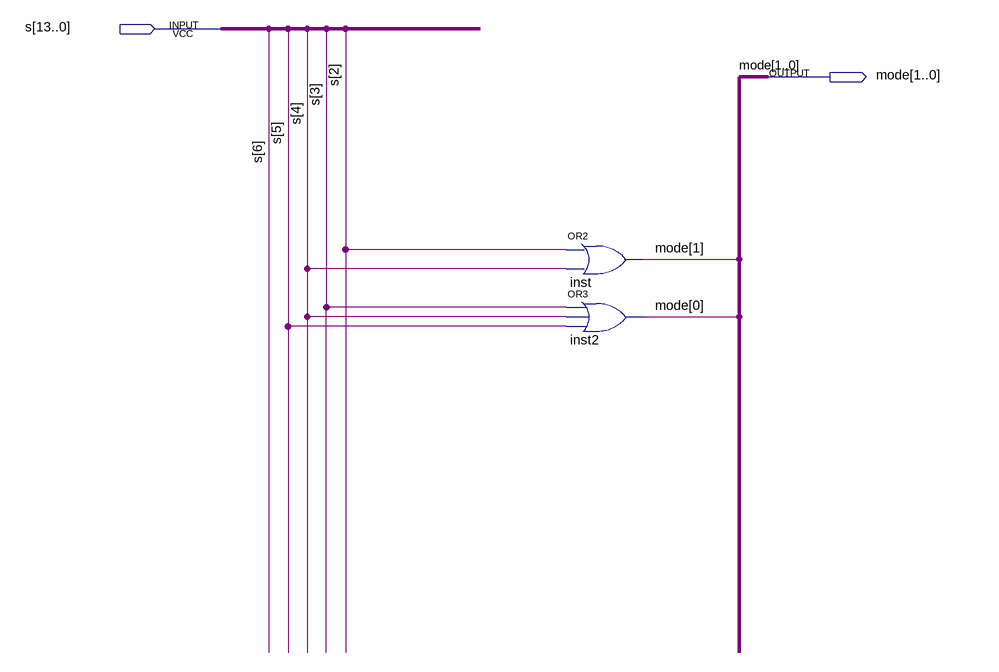
[diagram p0: schematic sheet]
// Quartus schematic triggerMode.bdf as structural Verilog: 2 symbols, 2 pins
module triggerMode (
  input  [13:0] s,
  output [1:0] mode
);

  or inst (mode[1], s[2], s[4]);
  or inst2 (mode[0], s[3], s[4], s[5]);
endmodule
